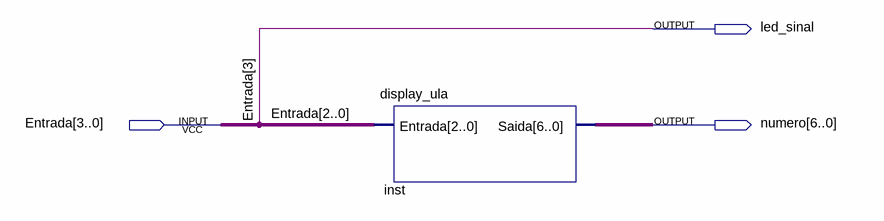
[diagram p0: schematic sheet]
// Quartus schematic conversor_ula.bdf as structural Verilog: 1 symbols, 3 pins
module conversor_ula (
  input  [3:0] Entrada,
  output led_sinal,
  output [6:0] numero
);

  display_ula inst (.Entrada(Entrada[2:0]), .Saida(numero));

  assign led_sinal = Entrada[3];
endmodule
